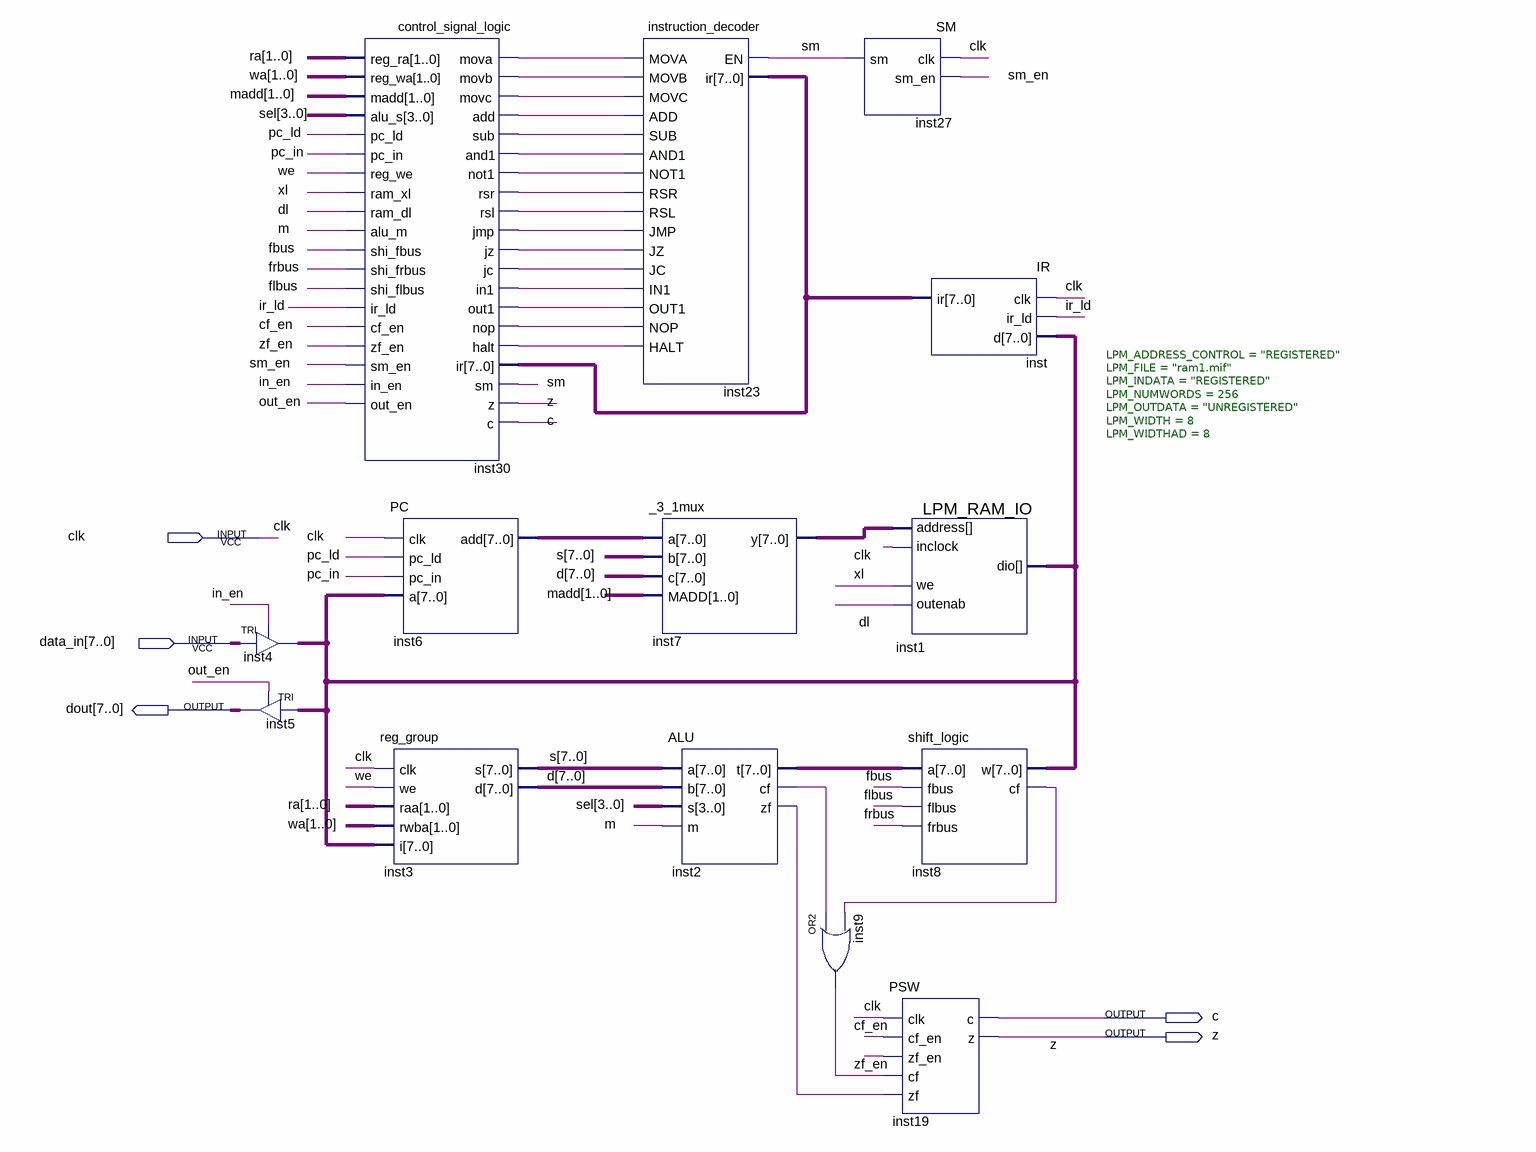
[diagram p0: schematic sheet]
// Quartus schematic computer.bdf as structural Verilog: 14 symbols, 5 pins
module computer (
  input  clk,
  input  [7:0] data_in,
  output [7:0] dout,
  output c,
  output z
);

  wire cf_en, dl, fbus, flbus, frbus, in_en, inst2_cf, inst2_zf, inst8_cf, inst9_out, inst23_add,
       inst23_and1, inst23_halt, inst23_in1, inst23_jc, inst23_jmp, inst23_jz, inst23_mova, inst23_movb,
       inst23_movc, inst23_nop, inst23_not1, inst23_out1, inst23_rsl, inst23_rsr, inst23_sub, ir_ld, m,
       out_en, pc_in, pc_ld, sm, sm_en, we, xl, zf_en;
  wire [1:0] madd, ra, wa;
  wire [3:0] sel;
  wire [7:0] d, inst2_t, inst4_out, inst6_add, inst7_y, inst_ir, s;

  TRI inst4[7:0] (.IN(data_in), .OE(in_en), .OUT(inst4_out));
  TRI inst5[7:0] (.IN(inst4_out), .OE(out_en), .OUT(dout));
  control_signal_logic inst30 (
    .mova(inst23_mova), .movb(inst23_movb), .movc(inst23_movc), .add(inst23_add), .sub(inst23_sub),
    .and1(inst23_and1), .not1(inst23_not1), .rsr(inst23_rsr), .rsl(inst23_rsl), .jmp(inst23_jmp),
    .jz(inst23_jz), .jc(inst23_jc), .in1(inst23_in1), .out1(inst23_out1), .nop(inst23_nop),
    .halt(inst23_halt), .ir(inst_ir), .sm(sm), .z(z), .c(c), .reg_ra(ra), .reg_wa(wa), .madd(madd),
    .alu_s(sel), .pc_ld(pc_ld), .pc_in(pc_in), .reg_we(we), .ram_xl(xl), .ram_dl(dl), .alu_m(m),
    .shi_fbus(fbus), .shi_frbus(frbus), .shi_flbus(flbus), .ir_ld(ir_ld), .cf_en(cf_en), .zf_en(zf_en),
    .sm_en(sm_en), .in_en(in_en), .out_en(out_en));
  PC inst6 (.clk(clk), .pc_ld(pc_ld), .pc_in(pc_in), .a(inst4_out), .add(inst6_add));
  reg_group inst3 (.clk(clk), .we(we), .raa(ra), .rwba(wa), .i(inst4_out), .s(s), .d(d));
  instruction_decoder inst23 (
    .EN(sm), .ir(inst_ir), .MOVA(inst23_mova), .MOVB(inst23_movb), .MOVC(inst23_movc), .ADD(inst23_add),
    .SUB(inst23_sub), .AND1(inst23_and1), .NOT1(inst23_not1), .RSR(inst23_rsr), .RSL(inst23_rsl),
    .JMP(inst23_jmp), .JZ(inst23_jz), .JC(inst23_jc), .IN1(inst23_in1), .OUT1(inst23_out1), .NOP(inst23_nop),
    .HALT(inst23_halt));
  _3_1mux inst7 (.a(inst6_add), .b(s), .c(d), .MADD(madd), .y(inst7_y));
  ALU inst2 (.a(s), .b(d), .s(sel), .m(m), .t(inst2_t), .cf(inst2_cf), .zf(inst2_zf));
  SM inst27 (.clk(clk), .sm_en(sm_en), .sm(sm));
  or inst9 (inst9_out, inst2_cf, inst8_cf);
  IR inst (.clk(clk), .ir_ld(ir_ld), .d(inst4_out), .ir(inst_ir));
  LPM_RAM_IO #(.LPM_ADDRESS_CONTROL("REGISTERED"), .LPM_FILE("ram1.mif"), .LPM_INDATA("REGISTERED"), .LPM_NUMWORDS(256), .LPM_OUTDATA("UNREGISTERED"), .LPM_WIDTH(8), .LPM_WIDTHAD(8)) inst1 (
    .address(inst7_y), .inclock(clk), .we(xl), .outenab(dl), .dio(inst4_out));
  shift_logic inst8 (.a(inst2_t), .fbus(fbus), .flbus(flbus), .frbus(frbus), .w(inst4_out), .cf(inst8_cf));
  PSW inst19 (.clk(clk), .cf_en(cf_en), .zf_en(zf_en), .cf(inst9_out), .zf(inst2_zf), .c(c), .z(z));
endmodule
